# Altium schematic sheet LP590_LDO_Regulator.SchDoc
size A
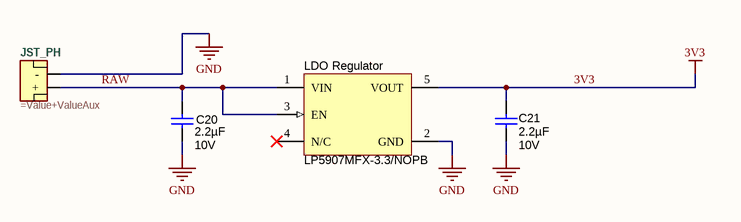
[diagram p0: LP590_LDO_Regulator.SchDoc]

## Parts
C20  ValueDisplayed: 2.2µF  Value2: 10V  [1608[0603]]  (hidden comment: GRM188R71A225KE15D)
C21  ValueDisplayed: 2.2µF  Value2: 10V  [1608[0603]]  (hidden comment: GRM188R71A225KE15D)
JST_PH  (no value)  [S2B-EH]
LDO_Regulator  LP5907MFX-3.3/NOPB  [DBV005_N]

## Nets
3V3: C21.2 LDO_Regulator.5(VOUT)
GND: C20.1 C21.1 JST_PH.2(-) LDO_Regulator.2(GND)
RAW: C20.2 JST_PH.1(+) LDO_Regulator.1(VIN) LDO_Regulator.3(EN)

Not connected (* = marked no-connect by the designer): LDO_Regulator 4(N/C)*

## Library data of the parts
C20 = GRM188R71A225KE15D: CAP, CERM, 2.2uF, 10V, +/-10%, X7R, 0603; Manufacturer: MuRata; Polarized: N; CompType: Capacitor; U/M: EA; Cap_F: 0.0000022; Tolerance_%: 10; ESR_Ohm: 0.009; Value1: 0.009 ohm; TaMin_C: -55; TaMax_C: 125; Cap_Case: 0603; SymbolVersion: 2008-07-09; Value: 2.2uF; PartNumber: GRM188R71A225KE15D; PackageReference: 0603; RoHS: Y; VDC_V: 10; MountType: SMT; Technology: Ceramic; TempCo: X7R; Published: 2008-06-19; Publisher: Texas Instruments; LatestRevisionDate: 2014-07-08; ComponentLink1Description: Datasheet link; ComponentLink1URL: http://search.murata.co.jp/Ceramy/PnsearchViewAction.do?HnOFG=ON&HnNFG=ON&SEL_CNT=50&sLang=en&sKey=GRM188R71A225KE15D&x=9&y=9&search=startwith; Supplier 1: Digi-Key; Supplier Part Number 1: 490-4520-1-ND; Supplier 2: Mouser; Supplier Part Number 2: 81-GRM188R71A225KE15; Supplier 3: Farnell; Supplier Part Number 3: 1797012
C21 = GRM188R71A225KE15D: CAP, CERM, 2.2 µF, 10 V, +/- 10%, X7R, 0603; Manufacturer: MuRata; Polarized: N; CompType: Capacitor; Value: 2.2uF; U/M: EA; Cap_F: 0.0000022; Tolerance_%: 10; ESR_ohm: 0.009; Value1: 0.009 ohm; TaMin_C: -55; TaMax_C: 125; Cap_Case: 0603; SymbolVersion: 2008-07-09; PartNumber: GRM188R71A225KE15D; PackageReference: 0603; RoHS: Y; VDC_V: 10; MountType: SMT; Technology: Ceramic; TempCo: X7R; Published: 2008-06-19; Publisher: Texas Instruments; LatestRevisionDate: 2014-07-21; ComponentLink1Description: Datasheet link; ComponentLink1URL: http://search.murata.co.jp/Ceramy/PnsearchViewAction.do?HnOFG=ON&HnNFG=ON&SEL_CNT=50&sLang=en&sKey=GRM188R71A225KE15D&x=9&y=9&search=startwith; Supplier 1: Digi-Key; Supplier Part Number 1: 490-4520-1-ND; Supplier 2: Mouser; Supplier Part Number 2: 81-GRM188R71A225KE15; Supplier 3: Farnell; Supplier Part Number 3: 1797012
JST_PH = JST-2: =Description
LDO_Regulator = LP5907MFX-3.3/NOPB: ULTRA LOW-NOISE, 250-mA LINEAR REGULATOR FOR RF AND ANALOG CIRCUITS REQUIRES NO BYPASS CAPACITOR, DBV0005A; Manufacturer: Texas Instruments; Alternate Manufacturer: None; CompType: IC; SymbolCreator: a0799628; U/M: EA; PackageReference: DBV0005A; Publisher: Texas Instruments; PartNumber: LP5907MFX-3.3/NOPB; RoHS: Y; ComponentLink1Description: Datasheet Link; ComponentLink1URL: http://www.ti.com/lit/ds/symlink/lp5907.pdf; SymbolVersion: 2014-03-21; MountType: SMT; LatestRevisionDate: 2014-07-28